# EAGLE design Left_Glove (EAGLE 7.2.0)
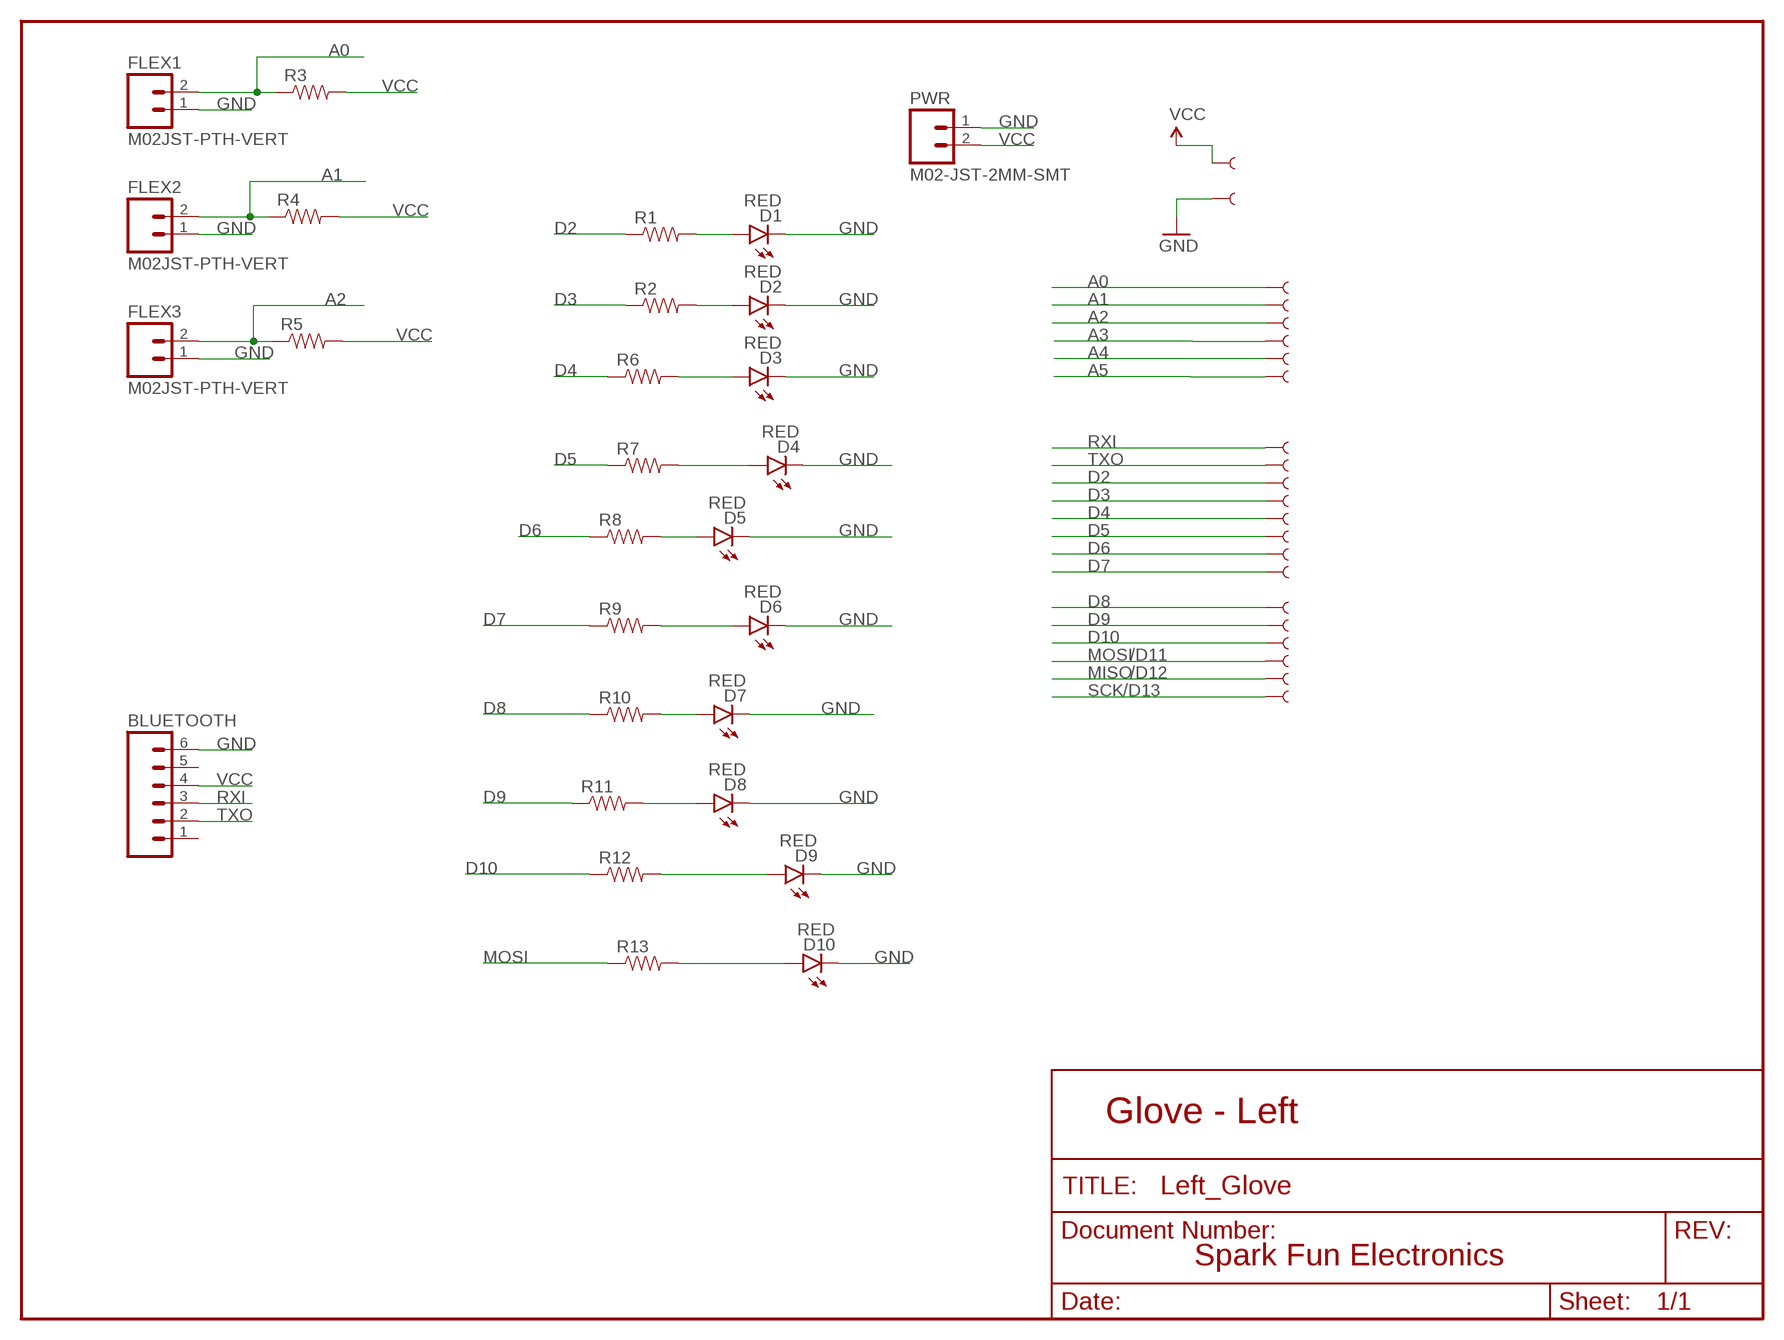
[diagram p0: schematic, sheet 1]

## Parts
BLUETOOTH  M06LOCK  [1X06_LOCK]
D1  RED  LED-RED1206  [LED-1206]
D2  RED  LED-RED1206  [LED-1206]
D3  RED  LED-RED1206  [LED-1206]
D4  RED  LED-RED1206  [LED-1206]
D5  RED  LED-RED1206  [LED-1206]
D6  RED  LED-RED1206  [LED-1206]
D7  RED  LED-RED1206  [LED-1206]
D8  RED  LED-RED1206  [LED-1206]
D9  RED  LED-RED1206  [LED-1206]
D10  RED  LED-RED1206  [LED-1206]
FLEX1  M02JST-PTH-VERT  [JST-2-PTH-VERT]
FLEX2  M02JST-PTH-VERT  [JST-2-PTH-VERT]
FLEX3  M02JST-PTH-VERT  [JST-2-PTH-VERT]
PWR  M02-JST-2MM-SMT  [JST-2-SMD]
R1  RESISTOR1206  [1206]
R2  RESISTOR1206  [1206]
R3  RESISTOR1206  [1206]
R4  RESISTOR1206  [1206]
R5  RESISTOR1206  [1206]
R6  RESISTOR1206  [1206]
R7  RESISTOR1206  [1206]
R8  RESISTOR1206  [1206]
R9  RESISTOR1206  [1206]
R10  RESISTOR1206  [1206]
R11  RESISTOR1206  [1206]
R12  RESISTOR1206  [1206]
R13  RESISTOR1206  [1206]
U$22  SEWTAP1  [PETAL-LONG-1]
U$23  SEWTAP1  [PETAL-LONG-1]
U$24  SEWTAP1  [PETAL-LONG-1]
U$26  SEWTAP1  [PETAL-LONG-1]
U$27  SEWTAP1  [PETAL-LONG-1]
U$28  SEWTAP1  [PETAL-LONG-1]
U$29  SEWTAP1  [PETAL-LONG-1]
U$30  SEWTAP1  [PETAL-LONG-1]
U$31  SEWTAP1  [PETAL-LONG-1]
U$32  SEWTAP1  [PETAL-LONG-1]
U$33  SEWTAP1  [PETAL-LONG-1]
U$34  SEWTAP1  [PETAL-LONG-1]
U$35  SEWTAP1  [PETAL-LONG-1]
U$36  SEWTAP1  [PETAL-LONG-1]
U$37  SEWTAP1  [PETAL-LONG-1]
U$38  SEWTAP1  [PETAL-LONG-1]
U$39  SEWTAP1  [PETAL-LONG-1]
U$40  SEWTAP1  [PETAL-LONG-1]
U$41  SEWTAP1  [PETAL-LONG-1]
U$42  SEWTAP1  [PETAL-LONG-1]
U$43  SEWTAP1  [PETAL-LONG-1]
U$44  SEWTAP1  [PETAL-LONG-1]

## Nets
A0: FLEX1.2 R3.1 U$24.P$1
A1: FLEX2.2 R4.1 U$26.P$1
A2: FLEX3.2 R5.1 U$27.P$1
A3: U$28.P$1
A4: U$29.P$1
A5: U$30.P$1
D2: R1.1 U$33.P$1
D3: R2.1 U$34.P$1
D4: R6.1 U$35.P$1
D5: R7.1 U$36.P$1
D6: R8.1 U$37.P$1
D7: R9.1 U$38.P$1
D8: R10.1 U$39.P$1
D9: R11.1 U$40.P$1
D10: R12.1 U$41.P$1
GND [VCC]: BLUETOOTH.6 D1.C D2.C D3.C D4.C D5.C D6.C D7.C D8.C D9.C D10.C FLEX1.1 FLEX2.1 FLEX3.1 PWR.1 U$23.P$1
MISO: U$43.P$1
MOSI: R13.1 U$42.P$1
N$1: D10.A R13.2
N$2: D2.A R2.2
N$3: D1.A R1.2
N$7: D3.A R6.2
N$10: D4.A R7.2
N$13: D5.A R8.2
N$16: D6.A R9.2
N$19: D7.A R10.2
N$22: D8.A R11.2
N$25: D9.A R12.2
RXI: BLUETOOTH.3 U$31.P$1
SCK: U$44.P$1
TXO: BLUETOOTH.2 U$32.P$1
VCC [VCC]: BLUETOOTH.4 PWR.2 R3.2 R4.2 R5.2 U$22.P$1
Unconnected: BLUETOOTH.1 BLUETOOTH.5

## Notes on the sheet
- /D11
- /D12
- /D13
- Glove - Left
- Spark Fun Electronics

## Library data of the parts
BLUETOOTH = SparkFun-Connectors:M06: Header 6 Standard 6-pin 0.1" header. Use with straight break away headers (SKU : PRT-00116), right angle break away headers (PRT-00553), swiss pins (PRT-00743), machine pins (PRT-00117), and female headers (PRT-00115). Molex polarized connector foot print use with SKU : PRT-08094 with associated crimp pins and housings. NOTES ON THE VARIANTS LOCK and LOCK_LONGPADS... This footprint was designed to help hold the alignment of a through-hole component (i.e. 6-pin header) while soldering it into place. You may notice that each hole has been shifted either up or down by 0.005 of an inch from it's more standard position (which is a perfectly straight line). This slight alteration caused the pins (the squares in the middle) to touch the edges of the holes. Because they are alternating, it causes a "brace" to hold the component in place. 0.005 has proven to be the perfect amount of "off-center" position when using our standard breakaway headers. Although looks a little odd when you look at the bare footprint, once you have a header in there, the alteration is very hard to notice. Also,if you push a header all the way into place, it is covered up entirely on the bottom side. This idea of altering the position of holes to aid alignment will be further integrated into the Sparkfun Library for other footprints. It can help hold any component with 3 or more connection pins.
D1-D10 = SparkFun-LED:LED-RED: Assorted Red LEDs LilyPad 1206- DIO-09912 1206- DIO-00809 0603- DIO-00819; PROD_ID: DIO-00809
FLEX1-FLEX3 = SparkFun-Connectors:M02: Standard 2-pin 0.1" header. Use with - straight break away headers ( PRT-00116) - right angle break away headers (PRT-00553) - swiss pins (PRT-00743) - machine pins (PRT-00117) - female headers (PRT-00115) Molex polarized connector foot print use with: PRT-08233 with associated crimp pins and housings. 2.54_SCREWTERM for use with PRT-10571. 3.5mm Screw Terminal footprints for PRT-08084 5mm Screw Terminal footprints for use with PRT-08432
PWR = SparkFun-Connectors:M02: Standard 2-pin 0.1" header. Use with - straight break away headers ( PRT-00116) - right angle break away headers (PRT-00553) - swiss pins (PRT-00743) - machine pins (PRT-00117) - female headers (PRT-00115) Molex polarized connector foot print use with: PRT-08233 with associated crimp pins and housings. 2.54_SCREWTERM for use with PRT-10571. 3.5mm Screw Terminal footprints for PRT-08084 5mm Screw Terminal footprints for use with PRT-08432; PROD_ID: CONN-08352
R1-R13 = SparkFun-Passives:RESISTOR: Resistor Basic schematic elements and footprints for 0603, 1206, and PTH resistors.
U$22-U$24 U$26-U$44 = LilyPad-Wearables:SEWTAP

## Net classes
0 Default: width 0.203 mm
1 VCC: width 0.305 mm

## Board
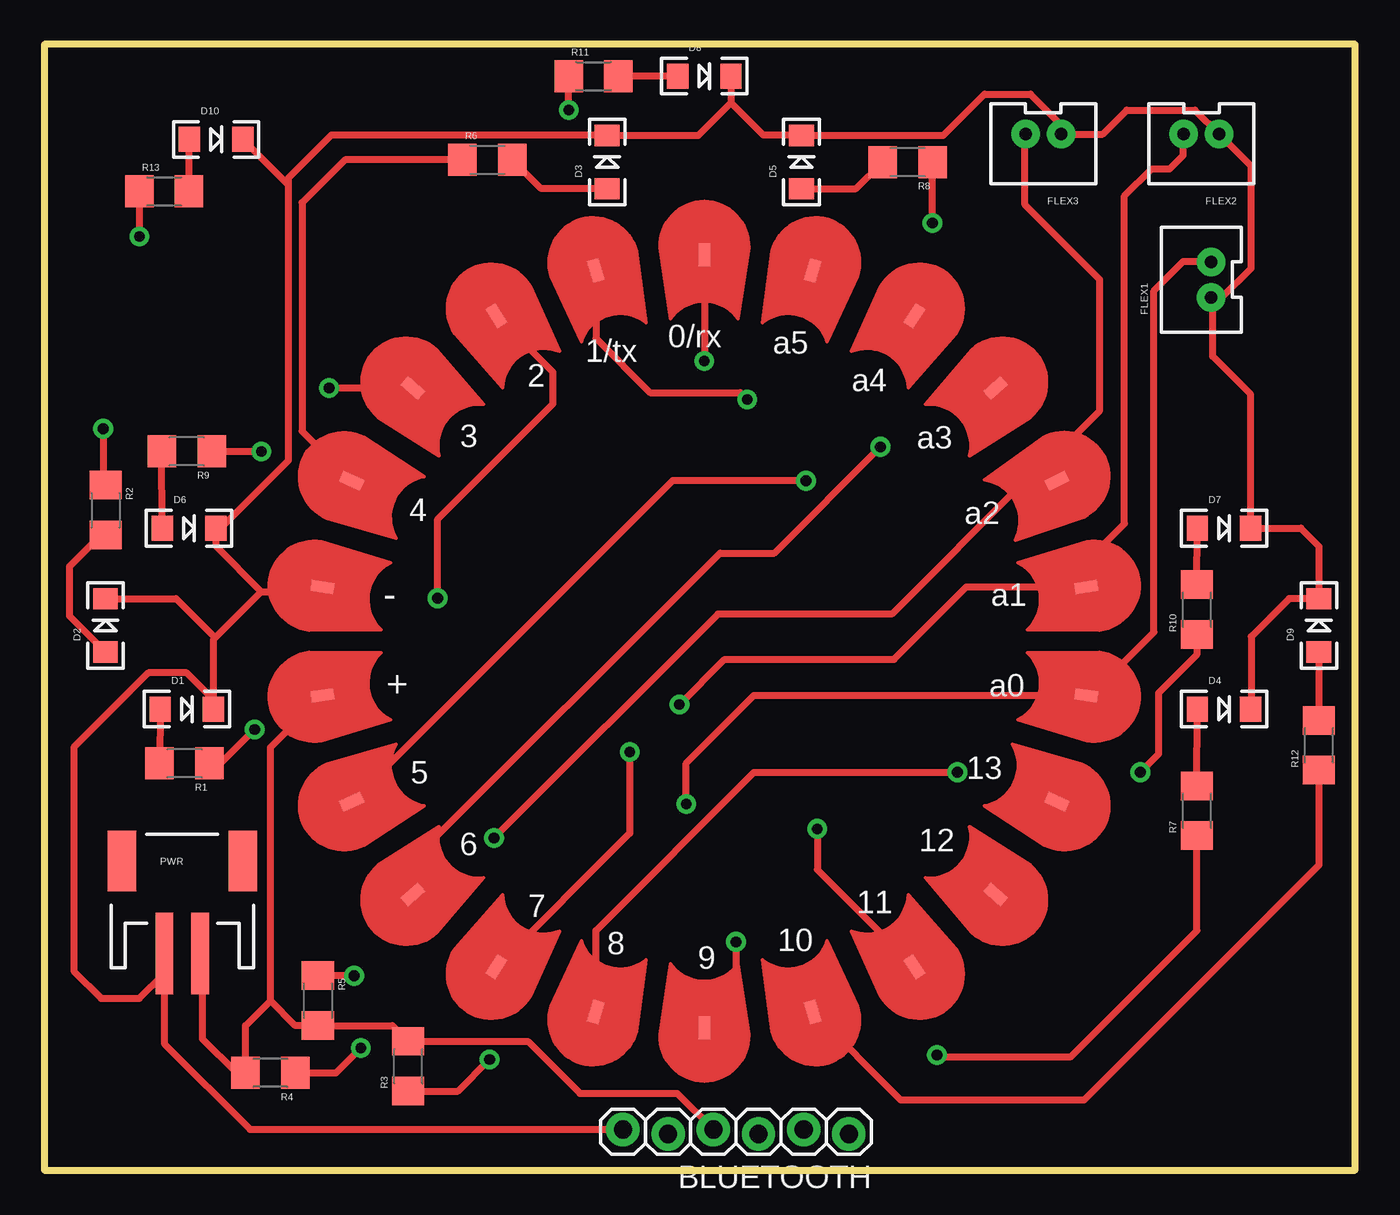
[diagram p1: board, top side]
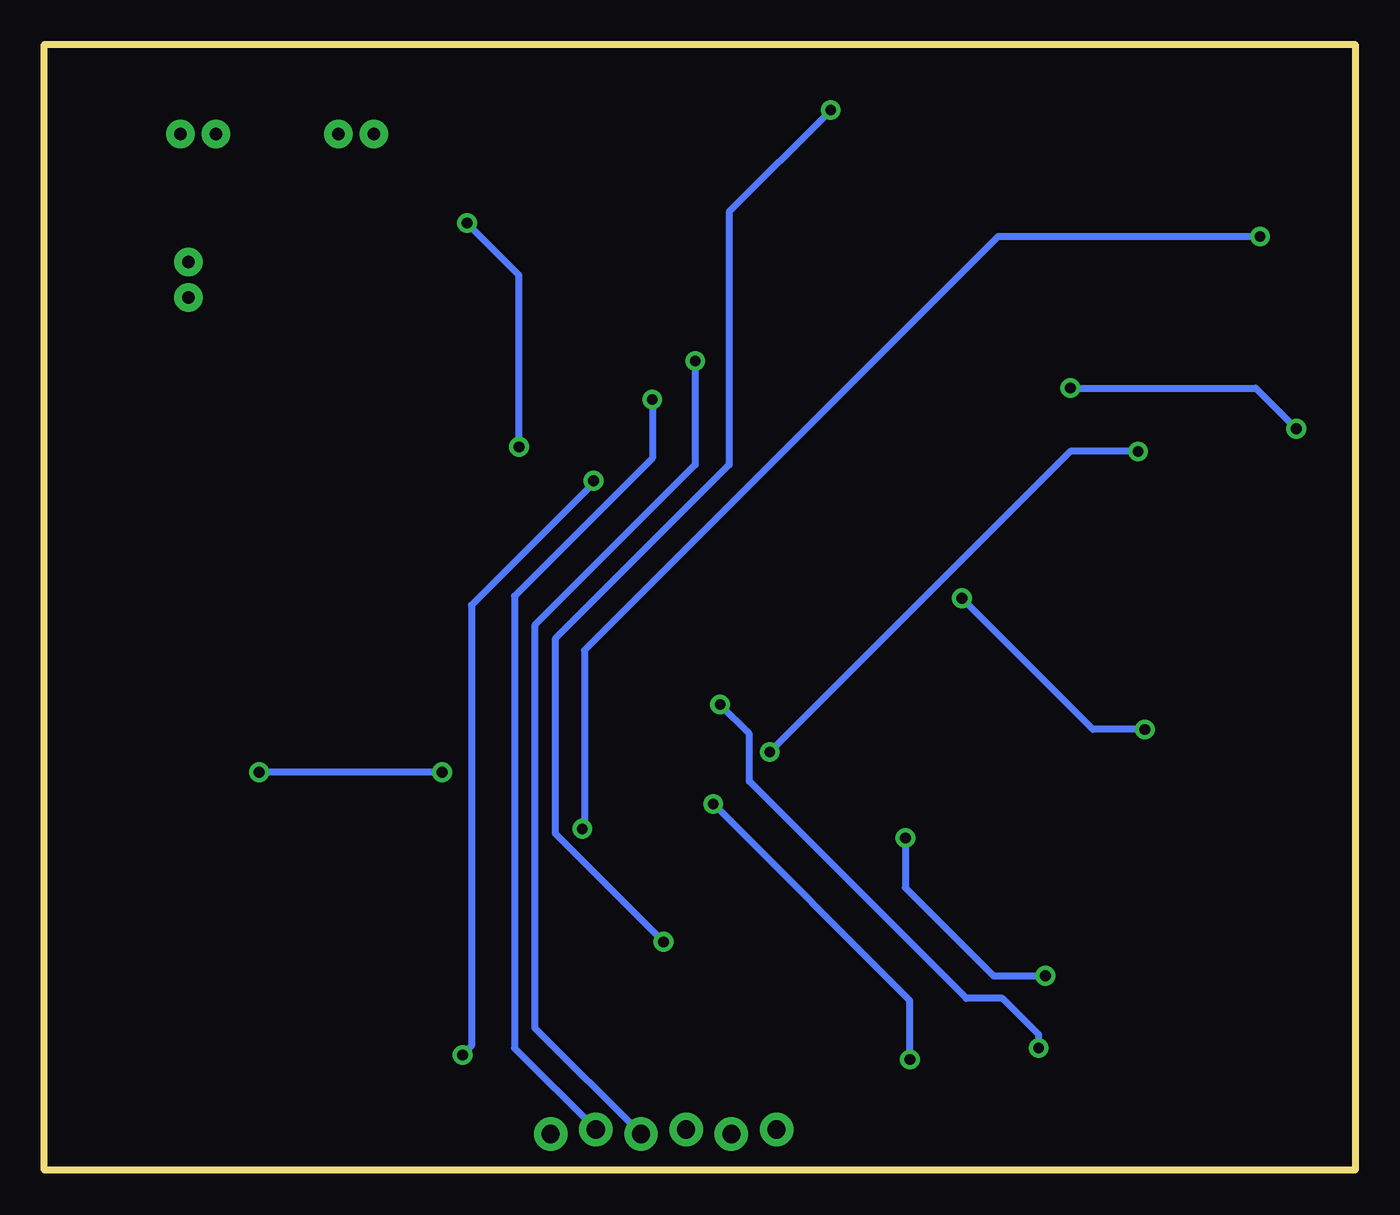
[diagram p2: board, bottom side, seen from below]

Size 73.66 x 63.25 mm. Coordinates in mm from the lower left corner, seen from the top.
Outline: 0,63.25 0,0 73.66,0 73.66,63.25 0,63.25
Copper layers (1*16): Top 0.035mm / dielectric 1.5mm / Bottom 0.035mm
Design rules "SparkFun": minimum track width 8mil, minimum drill 20mil, track to track 8mil, track to pad 8mil, pad to pad 8mil, via to via 8mil, smd to smd 8mil, copper to edge 10mil, drill to drill 8mil, minimum pad ring 12mil, minimum via ring 10mil, stop-mask expansion 4mil, vias tented up to drill 20mil, thermal gap 10mil

### Footprints (pad centres in the part's own frame; a part is rotated, then mirrored left to right if it is on the bottom)
1X06_LOCK = drill 1.016 pad 1.88: 1 0,0; 2 2.54,-0.254; 3 5.08,0; 4 7.62,-0.254; 5 10.16,0; 6 12.7,-0.254
LED-1206 = smd 1.2 x 1.4: A -1.5,0; C 1.5,0
JST-2-PTH-VERT = drill 0.7 pad 1.6: 1 -1,-0.55; 2 1,-0.55
JST-2-SMD = smd 1 x 4.6: 1 -1,-3.7; 2 1,-3.7 | smd 1.6 x 3.4: NC1 -3.4,1.5; NC2 3.4,1.5
1206 = smd 1.6 x 1.8: 1 -1.4,0; 2 1.4,0
PETAL-LONG-1 = smd 1.27 x 0.635: P$1 0,0

### Placement (x,y rotation side)
BLUETOOTH  45.21,2.03 180 top
D1  8,25.91 0 top
D2  3.43,30.61 90 top
D3  31.62,56.64 90 top
D4  66.29,25.91 0 top
D5  42.55,56.64 90 top
D6  8.13,36.07 0 top
D7  66.29,36.07 0 top
D8  37.08,61.47 0 top
D9  71.63,30.61 90 top
D10  9.65,57.91 0 top
FLEX1  65.02,50.04 90 top
FLEX2  65.02,57.66 180 top
FLEX3  56.13,57.66 180 top
PWR  7.75,15.88 0 top
R1  7.87,22.86 180 top
R2  3.43,37.08 270 top
R3  20.45,5.84 90 top
R4  12.7,5.46 180 top
R5  15.37,9.53 270 top
R6  24.89,56.77 0 top
R7  64.77,20.19 90 top
R8  48.51,56.64 180 top
R9  8,40.39 180 top
R10  64.77,31.5 90 top
R11  30.86,61.47 0 top
R12  71.63,23.88 90 top
R13  6.73,54.99 0 top
U$22  15.62,26.67 8.2 top
U$23  15.62,32.77 351.8 top
U$24  58.55,26.67 171.8 top
U$26  58.55,32.77 188.2 top
U$27  56.9,38.73 207.1 top
U$28  53.47,43.94 220.9 top
U$29  48.9,48.01 237.3 top
U$30  43.18,50.55 253.7 top
U$31  37.08,51.43 270 top
U$32  30.99,50.55 286.3 top
U$33  25.4,48.01 302.7 top
U$34  20.7,43.94 319.1 top
U$35  17.27,38.73 335.5 top
U$36  17.27,20.7 24.5 top
U$37  20.7,15.49 40.9 top
U$38  25.4,11.43 57.3 top
U$39  30.99,8.89 73.7 top
U$40  37.08,8 90 top
U$41  43.18,8.89 106.3 top
U$42  48.9,11.43 122.7 top
U$43  53.47,15.49 139.1 top
U$44  56.9,20.7 155.5 top

### Tracks (layer width: path | path; a pad name or v marks a point on that pad's centre or on a via)
A0  (via drill 0.6)
  Top 0.406: FLEX1.2 65.56,51.05 64.01,51.05 62.36,49.4 62.36,30.23 58.8,26.67 U$24.P$1 39.88,26.67 36.07,22.86 v36.07,20.57 | R3.1 23.24,4.44 v25.02,6.22
  Bottom 0.406: v25.02,6.22 25.02,9.53 v36.07,20.57
A1  (via drill 0.6)
  Top 0.406: FLEX2.2 64.01,58.19 64.01,57.02 63.25,56.26 62.23,56.26 60.71,54.74 60.71,36.32 58.55,34.16 U$26.P$1 51.82,32.77 47.75,28.7 38.23,28.7 v35.69,26.16 | R4.1 16.38,5.46 v17.78,6.86
  Bottom 0.406: v17.78,6.86 17.78,7.62 19.81,9.65 21.84,9.65 34.04,21.84 34.04,24.51 v35.69,26.16
A2  (via drill 0.6)
  Top 0.406: FLEX3.2 55.12,58.19 55.12,54.23 59.31,50.04 59.31,42.67 56.9,40.26 U$27.P$1 55.12,38.73 47.62,31.24 37.85,31.24 v25.27,18.67 | v17.4,10.92 R5.1
  Bottom 0.406: v25.27,18.67 25.27,15.88 20.32,10.92 v17.4,10.92
D2  (via drill 0.6)
  Top 0.406: R1.1 9.91,22.86 v11.81,24.77 | v22.1,32.13 22.1,36.58 28.57,43.05 28.57,44.83 U$33.P$1
  Bottom 0.406: v11.81,24.77 14.73,24.77 v22.1,32.13
D3  (via drill 0.6)
  Top 0.406: U$34.P$1 v16,43.94 | v3.3,41.66 3.3,38.61 R2.1
  Bottom 0.406: v16,43.94 5.59,43.94 v3.3,41.66
D4
  Top 0.406: R6.1 16.89,56.77 14.48,54.36 14.48,41.53 U$35.P$1
D5  (via drill 0.6)
  Top 0.406: v42.8,38.73 35.31,38.73 U$36.P$1 | R7.1 64.77,13.46 57.66,6.35 50.16,6.35 v50.16,6.48
  Bottom 0.406: v42.8,38.73 42.8,38.61 49.66,31.75 49.66,6.98 v50.16,6.48
D6  (via drill 0.6)
  Top 0.406: U$37.P$1 20.7,17.4 37.97,34.67 41.02,34.67 v46.99,40.64 | v49.91,53.21 R8.1
  Bottom 0.406: v46.99,40.64 46.99,50.29 v49.91,53.21
D7  (via drill 0.6)
  Top 0.406: R9.1 v12.19,40.39 | v32.89,23.5 32.89,18.92 U$38.P$1
  Bottom 0.406: v12.19,40.39 16,40.39 v32.89,23.5
D8  (via drill 0.6)
  Top 0.406: U$39.P$1 30.99,13.46 39.88,22.35 v51.31,22.35 | R10.1 64.77,28.95 62.61,26.8 62.61,23.37 v61.6,22.35
  Bottom 0.406: v51.31,22.35 v61.6,22.35
D9  (via drill 0.6)
  Top 0.406: v29.46,59.56 R11.1 | v38.86,12.83 38.86,9.78 U$40.P$1
  Bottom 0.406: v29.46,59.56 35.18,53.85 35.18,39.62 44.96,29.85 44.96,18.92 v38.86,12.83
D10
  Top 0.406: R12.1 71.63,17.14 58.42,3.94 48.13,3.94 U$41.P$1
GND
  Top 0.406: FLEX3.1 57.66,58.21 | 57.66,58.21 59.48,58.21 60.83,59.56 64.67,59.56 FLEX2.1 67.82,56.41 67.82,50.67 66.18,49.04 FLEX1.1 65.66,48.95 65.66,45.72 67.79,43.59 D7.C 70.61,36.07 71.63,35.05 D9.C 69.95,32.11 67.82,29.97 67.82,25.93 D4.C | D8.C 38.58,59.97 | D1.C 9.5,29.82 9.59,29.91 | 9.59,29.91 12.19,32.51 | 12.19,32.51 15.37,32.51 U$23.P$1 | 12.19,32.51 9.63,35.08 D6.C 9.91,36.07 13.72,39.88 13.72,55.35 | D2.C 7.39,32.11 9.59,29.91 | 38.58,59.97 40.39,58.17 42.52,58.17 D5.C 50.52,58.14 52.83,60.45 55.41,60.45 57.66,58.21 | 38.58,59.97 36.76,58.14 D3.C 31.6,58.17 16.13,58.17 13.72,55.75 13.72,55.35 | D1.C 9.5,25.8 | 6.73,11.05 5.33,9.65 3.17,9.65 1.65,11.18 1.65,23.75 5.84,27.94 8,27.94 9.5,26.44 D1.C | 6.73,11.05 6.73,12.16 PWR.1 | 6.73,11.05 6.73,7.11 11.56,2.29 BLUETOOTH.6 | 13.72,55.35 D10.C
MOSI  (via drill 0.6)
  Top 0.406: R13.1 v5.33,52.45 | v43.43,19.18 43.43,16.89 U$42.P$1
  Bottom 0.406: v5.33,52.45 20.07,52.45 43.31,29.21 43.31,19.3 v43.43,19.18
N$1
  Top 0.406: R13.2 8.13,57.94 D10.A
N$2
  Top 0.406: R2.2 3.17,35.68 1.4,33.91 1.4,31.14 D2.A
N$3
  Top 0.406: D1.A R1.2
N$7
  Top 0.406: D3.A 27.92,55.14 R6.2
N$10
  Top 0.406: R7.2 D4.A
N$13
  Top 0.406: D5.A 45.61,55.14 R8.2
N$16
  Top 0.406: D6.A R9.2
N$19
  Top 0.406: R10.2 D7.A
N$22
  Top 0.406: D8.A R11.2
N$25
  Top 0.406: D9.A R12.2
RXI  (via drill 0.6)
  Top 0.406: U$31.P$1 v37.08,45.47
  Bottom 0.406: v37.08,45.47 37.08,39.62 46.1,30.61 46.1,8 BLUETOOTH.3
TXO  (via drill 0.6)
  Top 0.406: U$32.P$1 30.99,46.74 34.04,43.69 39.12,43.69 v39.5,43.31
  Bottom 0.406: v39.5,43.31 39.5,40 47.24,32.26 47.24,6.86 BLUETOOTH.2
VCC
  Top 0.406: 12.7,9.53 14.1,8.12 R5.2 19.56,8.12 R3.2 27.17,7.24 30.1,4.32 35.56,4.32 BLUETOOTH.4 | 12.7,9.53 12.7,23.75 U$22.P$1 | PWR.2 8.89,12.03 8.89,7.37 10.79,5.46 R4.2 11.3,8.12 12.7,9.53

### Text on the board
tPlace: 0/rx | a5 | 1/tx | 2 | a4 | 3 | a3 | 4 | a2 | - | a1 | + | a0 | 13 | 5 | 12 | 6 | 7 | 11 | 8 | 10 | 9